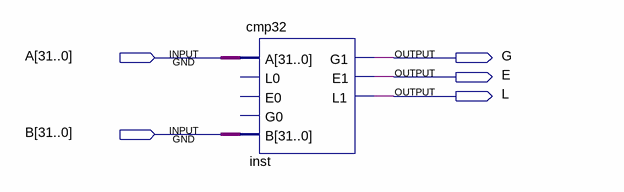
[diagram p0: schematic sheet]
// Quartus schematic cmp32u.bdf as structural Verilog: 1 symbols, 5 pins
module cmp32u (
  input  [31:0] A,
  input  [31:0] B,
  output G,
  output E,
  output L
);

  cmp32 inst (.A(A), .B(B), .G1(G), .E1(E), .L1(L));  // open: L0, E0, G0
endmodule
